# EAGLE design week7 (EAGLE 9.3.0)
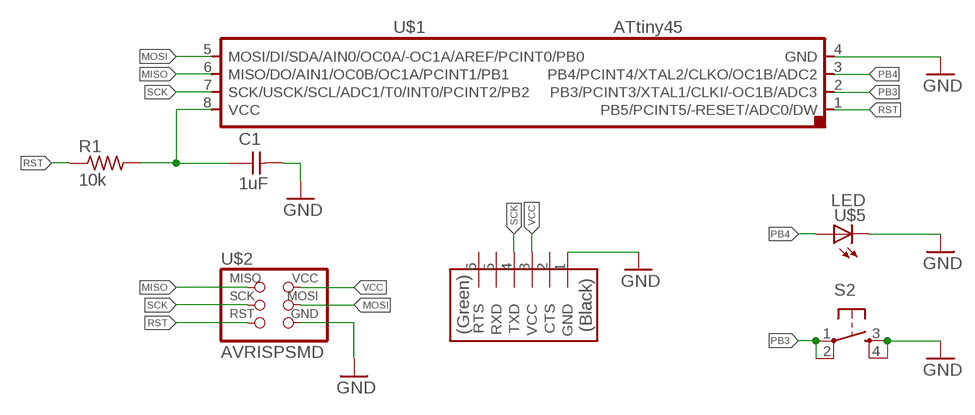
[diagram p0: schematic, sheet 1]

## Parts
C1  1uF  CAP-UNPOLARIZEDFAB  [C1206FAB]
R1  10k  RES-US1206  [R1206]
S2  6MM_SWITCH6MM_SWITCH  [6MM_SWITCH]
U$1  ATTINY45SI  [SOIC8]
U$2  AVRISPSMD  [2X03SMD]
U$3  FTDI-SMD-HEADER  [1X06SMD]
U$5  LED  [LED1206]

## Nets
GND: C1.2 S2.3(S) S2.4(S1) U$1.4(GND) U$2.6(GND) U$3.1(GND) U$5.2(C)
MISO: U$1.6(MISO/DO/AIN1/OC0B/OC1A/PCINT1/PB1) U$2.1(MISO)
MOSI: U$1.5(MOSI/DI/SDA/AIN0/OC0A/-OC1A/AREF/PCINT0/PB0) U$2.4(MOSI)
N$3: C1.1 R1.2 U$1.8(VCC)
PB3: S2.1(P) S2.2(P1) U$1.2(PB3/PCINT3/XTAL1/CLKI/-OC1B/ADC3)
PB4: U$1.3(PB4/PCINT4/XTAL2/CLKO/OC1B/ADC2) U$5.1(A)
RST: R1.1 U$1.1(PB5/PCINT5/-RESET/ADC0/DW) U$2.5(RST)
SCK: U$1.7(SCK/USCK/SCL/ADC1/T0/INT0/PCINT2/PB2) U$2.3(SCK) U$3.4(TXD)
VCC: U$2.2(VCC) U$3.3(VCC)
Unconnected: U$3.2(CTS) U$3.5(RXD) U$3.6(RTS)

## Library data of the parts
C1 = fab:CAP-UNPOLARIZED
R1 = fab:RES-US: Resistor (US Symbol) Variants with postfix FAB are widened to allow the routing of internal traces
S2 = fab:6MM_SWITCH: OMRON SWITCH
U$1 = fab:ATTINY45
U$2 = fab:AVRISP
U$3 = fab:FTDI-SMD-HEADER
U$5 = fab:LED: LED

## Net classes
0 default: width 0.305 mm

## Board
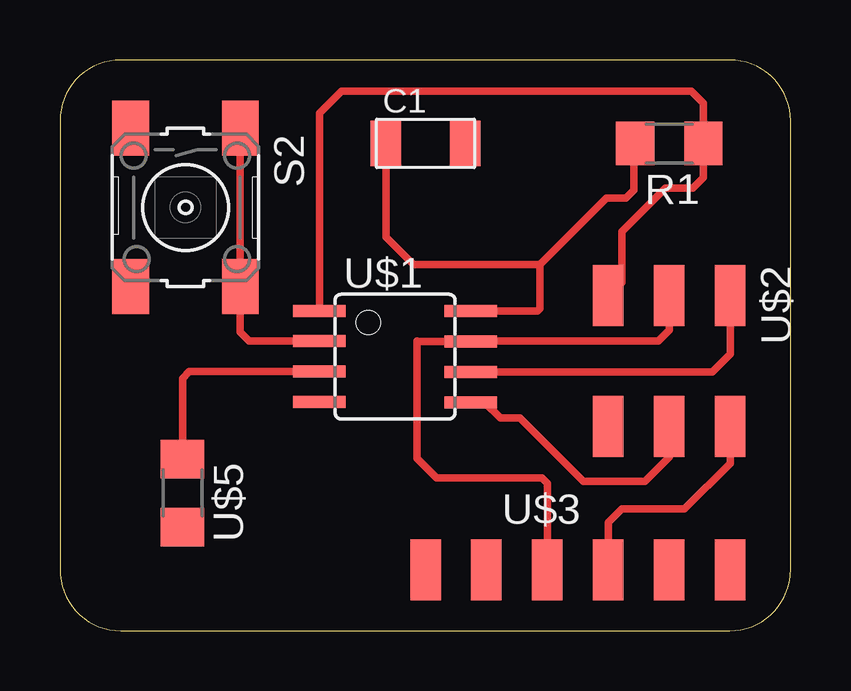
[diagram p1: board, top side]

Size 30.46 x 23.8 mm. Coordinates in mm from the lower left corner, seen from the top.
Outline: 0,21.26 0,2.54 arc90 2.54,0 27.92,0 arc90 30.46,2.54 30.46,21.26 arc90 27.92,23.8 2.54,23.8 arc90 0,21.26
Copper layers (1*16): Top 0.035mm / dielectric 1.5mm / Bottom 0.035mm
Design rules "default": minimum track width 6mil, minimum drill 0.35mm, track to track 6mil, track to pad 6mil, pad to pad 6mil, via to via 6mil, smd to smd 6mil, copper to edge 40mil, drill to drill 6mil, minimum pad ring 10mil, minimum via ring 8mil, stop-mask expansion 4mil, vias tented up to drill 0mil, thermal gap 10mil

### Footprints (pad centres in the part's own frame; a part is rotated, then mirrored left to right if it is on the bottom)
C1206FAB = smd 1.27 x 1.905: 1 -1.651,0; 2 1.651,0
R1206 = smd 1.6 x 1.803: 1 -1.422,0; 2 1.422,0
6MM_SWITCH = smd 2.286 x 1.524: 1 -3.302,2.286; 2 3.302,2.286; 3 -3.302,-2.286; 4 3.302,-2.286
SOIC8 = smd 0.5 x 2.2: 1 -1.905,-3.154; 2 -0.645,-3.154; 3 0.625,-3.154; 4 1.895,-3.154; 5 1.905,3.154; 6 0.635,3.154; 7 -0.635,3.154; 8 -1.905,3.154
2X03SMD = smd 2.54 x 1.27: 1 -2.54,2.54; 2 2.92,2.54; 3 -2.54,0; 4 2.92,0; 5 -2.54,-2.54; 6 2.92,-2.54
1X06SMD = smd 2.54 x 1.27: 1 0,6.35; 2 0,3.81; 3 0,1.27; 4 0,-1.27; 5 0,-3.81; 6 0,-6.35
LED1206 = smd 1.6 x 1.803: 1 -1.422,0; 2 1.422,0

### Placement (x,y rotation side)
C1  15.24,20.32 0 top
R1  25.4,20.32 180 top
S2  5.23,17.65 270 top
U$1  13.97,11.43 270 top
U$2  25.4,11.43 270 top
U$3  21.59,2.54 270 top
U$5  5.11,5.74 270 top

### Tracks (layer width: path | path; a pad name or v marks a point on that pad's centre or on a via)
MISO
  Top 0.305: U$2.1 27.94,11.53 27.2,10.79 U$1.6
MOSI
  Top 0.305: U$2.4 25.4,7.24 24.38,6.22 21.82,6.22 19.18,8.87 18.36,8.87 17.7,9.53 U$1.5
N$3
  Top 0.305: R1.2 23.93,20.32 | 23.93,20.32 | U$1.8 19.91,13.34 20.02,13.44 20.02,15.27 | 20.02,15.27 22.78,18.03 23.6,18.03 23.93,18.36 23.93,20.32 | C1.1 13.59,16.41 14.73,15.27 20.02,15.27
PB3
  Top 0.152: 10.79,12.06 U$1.2
  Top 0.305: S2.1 S2.2 7.52,12.45 7.89,12.07 U$1.2
PB4
  Top 0.305: U$1.3 5.39,10.8 5.11,10.52 U$5.1
RST
  Top 0.305: U$2.5 23.42,14.53 23.42,16.64 25.25,18.47 26.39,18.47 26.82,18.9 R1.1 26.82,22 26.31,22.5 11.73,22.5 10.82,21.59 U$1.1
SCK
  Top 0.305: U$2.3 25.4,12.55 24.94,12.09 17.15,12.09 U$1.7 14.91,12.06 14.88,12.09 14.88,7.19 15.7,6.38 20.09,6.38 20.32,6.15 U$3.4
VCC
  Top 0.305: U$3.3 22.86,4.52 23.42,5.08 26.04,5.08 27.94,6.99 U$2.2